# EAGLE design mainboard (EAGLE 9.6.1)
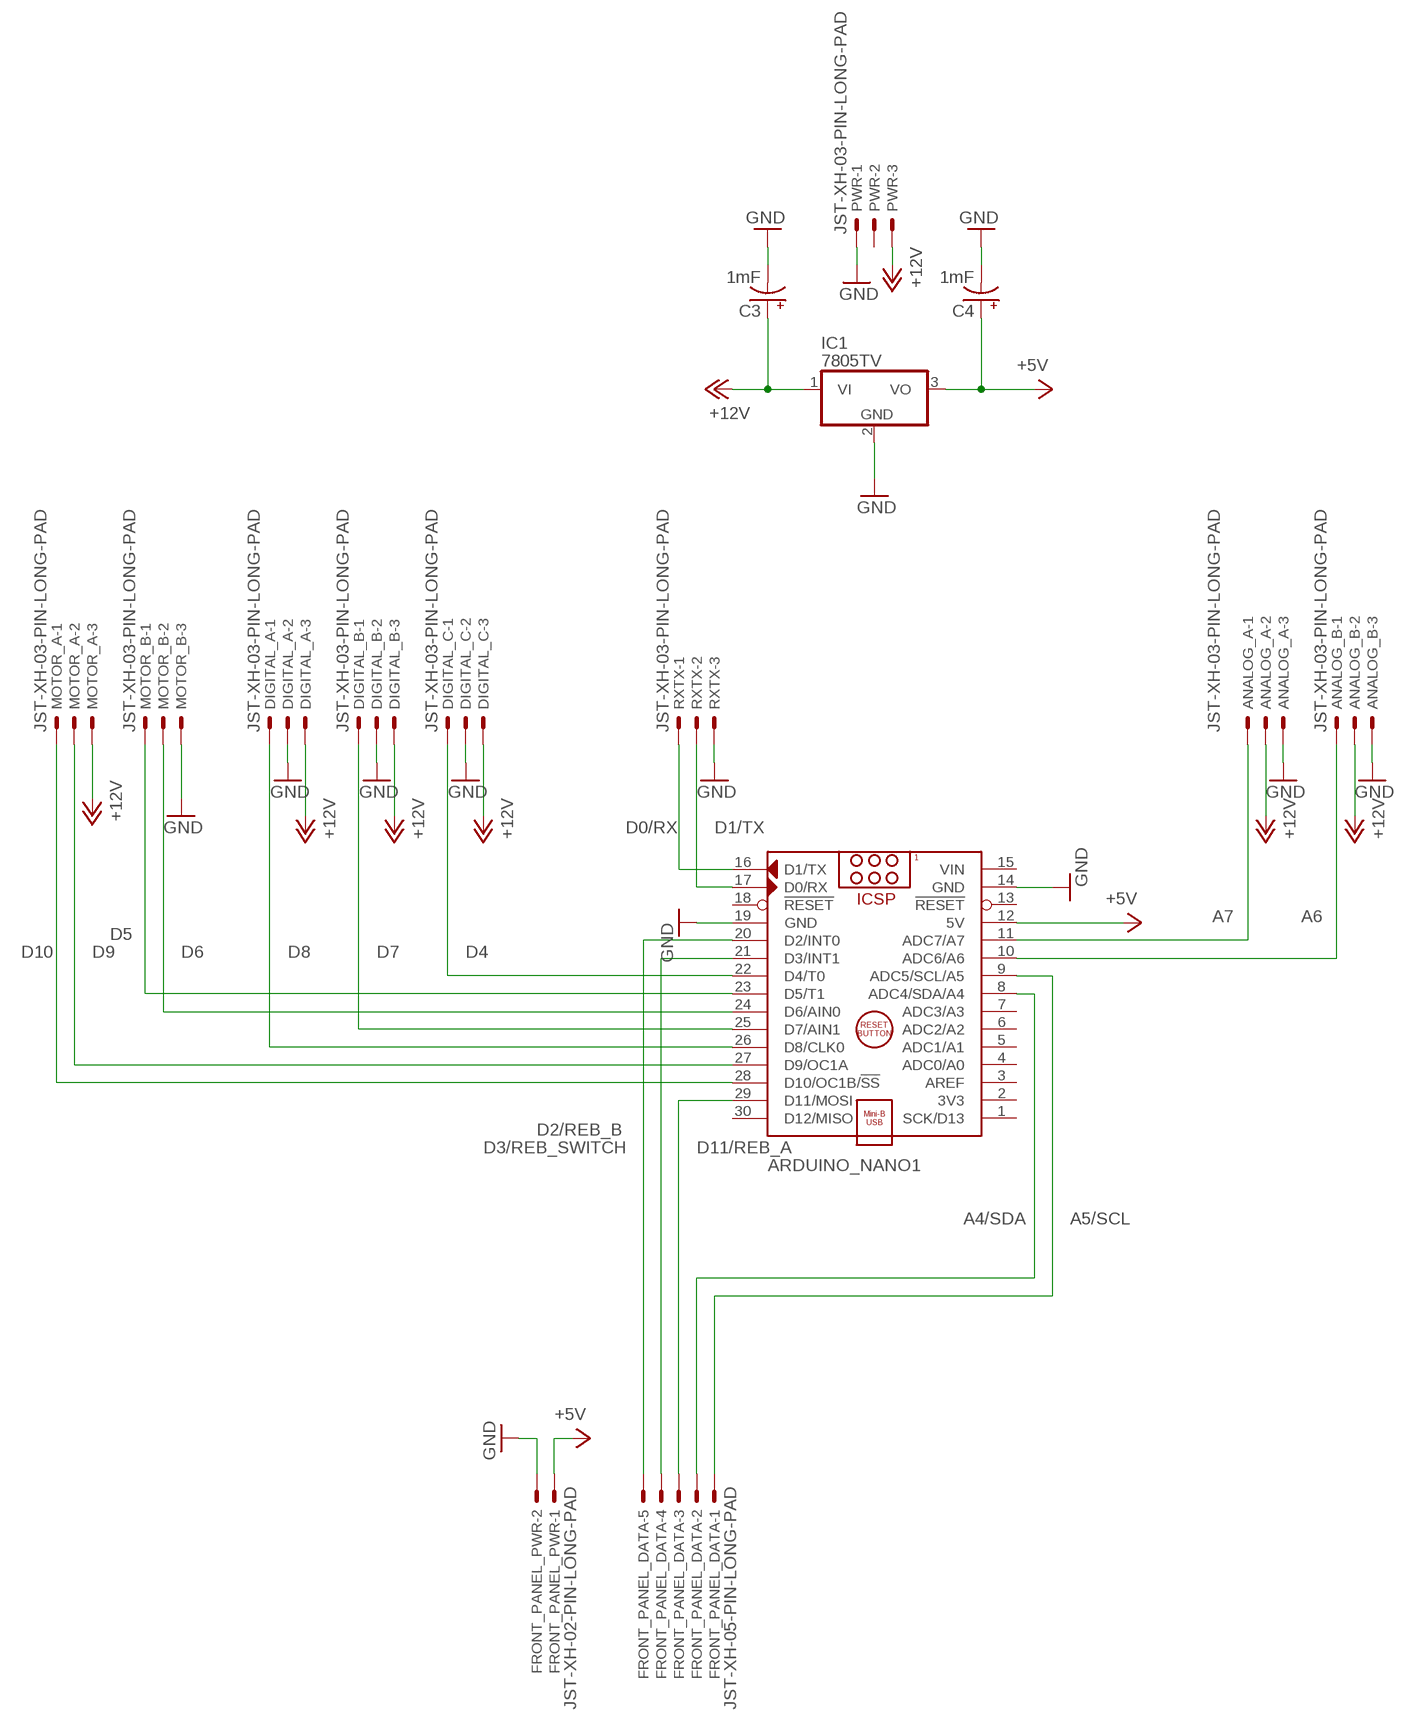
[diagram p0: schematic, sheet 1]

## Parts
ANALOG_A  JST-XH-03-PIN-LONG-PAD  [JST-XH-03-PACKAGE-LONG-PAD]
ANALOG_B  JST-XH-03-PIN-LONG-PAD  [JST-XH-03-PACKAGE-LONG-PAD]
ARDUINO_NANO1  ARDUINO_NANO  [ARDUINO_NANO]
C3  1mF  1000UF-RADIAL-5MM-25V-20%  [CPOL-RADIAL-5MM-10MM]
C4  1mF  1000UF-RADIAL-5MM-25V-20%  [CPOL-RADIAL-5MM-10MM]
DIGITAL_A  JST-XH-03-PIN-LONG-PAD  [JST-XH-03-PACKAGE-LONG-PAD]
DIGITAL_B  JST-XH-03-PIN-LONG-PAD  [JST-XH-03-PACKAGE-LONG-PAD]
DIGITAL_C  JST-XH-03-PIN-LONG-PAD  [JST-XH-03-PACKAGE-LONG-PAD]
FRONT_PANEL_DATA  JST-XH-05-PIN-LONG-PAD  [JST-XH-05-PACKAGE-LONG-PAD]
FRONT_PANEL_PWR  JST-XH-02-PIN-LONG-PAD  [JST-XH-02-PACKAGE-LONG-PAD]
IC1  7805TV  [TO220V]
MOTOR_A  JST-XH-03-PIN-LONG-PAD  [JST-XH-03-PACKAGE-LONG-PAD]
MOTOR_B  JST-XH-03-PIN-LONG-PAD  [JST-XH-03-PACKAGE-LONG-PAD]
PWR  JST-XH-03-PIN-LONG-PAD  [JST-XH-03-PACKAGE-LONG-PAD]
RXTX  JST-XH-03-PIN-LONG-PAD  [JST-XH-03-PACKAGE-LONG-PAD]

## Nets
+5V: ARDUINO_NANO1.12(5V) C4.+ FRONT_PANEL_PWR.1 IC1.3(VO)
+12V: ANALOG_A.2 ANALOG_B.2 C3.+ DIGITAL_A.3 DIGITAL_B.3 DIGITAL_C.3 IC1.1(VI) MOTOR_A.3 PWR.3
A4/SDA: ARDUINO_NANO1.8(ADC4/SDA/A4) FRONT_PANEL_DATA.2
A5/SCL: ARDUINO_NANO1.9(ADC5/SCL/A5) FRONT_PANEL_DATA.1
A6: ANALOG_B.1 ARDUINO_NANO1.10(ADC6/A6)
A7: ANALOG_A.1 ARDUINO_NANO1.11(ADC7/A7)
D0/RX: ARDUINO_NANO1.17(D0/RX) RXTX.2
D1/TX: ARDUINO_NANO1.16(D1/TX) RXTX.1
D2/REB_B: ARDUINO_NANO1.20(D2/INT0) FRONT_PANEL_DATA.5
D3/REB_SWITCH: ARDUINO_NANO1.21(D3/INT1) FRONT_PANEL_DATA.4
D4: ARDUINO_NANO1.22(D4/T0) DIGITAL_C.1
D5: ARDUINO_NANO1.23(D5/T1) MOTOR_B.1
D6: ARDUINO_NANO1.24(D6/AIN0) MOTOR_B.2
D7: ARDUINO_NANO1.25(D7/AIN1) DIGITAL_B.1
D8: ARDUINO_NANO1.26(D8/CLK0) DIGITAL_A.1
D9: ARDUINO_NANO1.27(D9/OC1A) MOTOR_A.2
D10: ARDUINO_NANO1.28(D10/OC1B/!SS) MOTOR_A.1
D11/REB_A: ARDUINO_NANO1.29(D11/MOSI) FRONT_PANEL_DATA.3
GND: ANALOG_A.3 ANALOG_B.3 ARDUINO_NANO1.14(GND) ARDUINO_NANO1.19(GND) C3.- C4.- DIGITAL_A.2 DIGITAL_B.2 DIGITAL_C.2 FRONT_PANEL_PWR.2 IC1.2(GND) MOTOR_B.3 PWR.1 RXTX.3
Unconnected: ARDUINO_NANO1.1(SCK/D13) ARDUINO_NANO1.2(3V3) ARDUINO_NANO1.3(AREF) ARDUINO_NANO1.4(ADC0/A0) ARDUINO_NANO1.5(ADC1/A1) ARDUINO_NANO1.6(ADC2/A2) ARDUINO_NANO1.7(ADC3/A3) ARDUINO_NANO1.13(!RESET) ARDUINO_NANO1.18(!RESET) ARDUINO_NANO1.30(D12/MISO) PWR.2

## Power pins joined to a net without a drawn wire
VIN: ARDUINO_NANO1.15(VIN)

## Library data of the parts
ANALOG_A ANALOG_B DIGITAL_A DIGITAL_B DIGITAL_C MOTOR_A MOTOR_B PWR RXTX = Rembrandt Electronics - JST XH Connectors v1-0:JST-XH-03-PIN: JST XH Connector 2 Pin Wire to board connector. Pitch: 2,54 mm, (0.100") Number of pins: 3 Created by Rembrandt Electronics www.rembrandtelectronics.com
ARDUINO_NANO1 = ArduinoNanoV30:ARDUINO_NANO: Arduino Nano V3.0 Module Overview: The Arduino Nano is a small, complete, and breadboard-friendly board based on the ATmega328 (Arduino Nano 3.x) or ATmega168 (Arduino Nano 2.x). It has more or less the same functionality of the Arduino Duemilanove, but in a different package. It lacks only a DC power jack, and works with a Mini-B USB cable instead of a standard one. The Nano was designed and is being produced by Gravitech <http://www.gravitech.us/arna30wiatp.html>. General specifications: Item Value Microcontroller Atmel ATmega168 or ATmega328 Operating Voltage (logic level) 5 V Input Voltage (recommended) 7-12 V Input Voltage (limits) 6-20 V Digital I/O Pins 14 (of which 6 provide PWM output) Analog Input Pins 8 DC Current per I/O Pin 40 mA Flash Memory 16 KB (ATmega168) or 32 KB (ATmega328) of which 2 KB used by bootloader SRAM 1 KB (ATmega168) or 2 KB (ATmega328) EEPROM 512 bytes (ATmega168) or 1 KB (ATmega328) Clock Speed 16 MHz Dimensions (Inches) 0.73" x 1.70" Dimensions (mm) 18mm x 45mm Overall height About 9 mm (not including pins) Weigth 5 g Power: The Arduino Nano can be powered via the Mini-B USB connection, 6-20V unregulated external power supply (pin 30), or 5V regulated external power supply (pin 27). The power source is automatically selected to the highest voltage source. Memory: The ATmega168 has 16 KB of flash memory for storing code (of which 2 KB is used for the bootloader); the ATmega328 has 32 KB, (also with 2 KB used for the bootloader). The ATmega168 has 1 KB of SRAM and 512 bytes of EEPROM (which can be read and written with the EEPROM library); the ATmega328 has 2 KB of SRAM and 1 KB of EEPROM. Input and Output: Each of the 14 digital pins on the Nano can be used as an input or output, using pinMode(), digitalWrite(), and digitalRead() functions. They operate at 5 volts. Each pin can provide or receive a maximum of 40 mA and has an internal pull-up resistor (disconnected by default) of 20-50 kOhms. In addition, some pins have specialized functions. Visit Arduino - ArduinoBoardNano <https://www.arduino.cc/en/Main/ArduinoBoardNano>
C3 C4 = SparkFun-Capacitors:1000UF: 1,000µF/1mF ceramic capacitors A capacitor is a passive two-terminal electrical component used to store electrical energy temporarily in an electric field. CAP-08070; PROD_ID: CAP-09538
FRONT_PANEL_DATA = Rembrandt Electronics - JST XH Connectors v1-0:JST-XH-05-PIN: JST XH Connector 2 Pin Wire to board connector. Pitch: 2,54 mm, (0.100") Number of pins: 5 Created by Rembrandt Electronics www.rembrandtelectronics.com
FRONT_PANEL_PWR = Rembrandt Electronics - JST XH Connectors v1-0:JST-XH-02-PIN: JST XH Connector 2 Pin Wire to board connector. Pitch: 2,54 mm, (0.100") Number of pins: 2 Created by Rembrandt Electronics www.rembrandtelectronics.com
IC1 = linear:78*: Positive VOLTAGE REGULATOR Source: http://cache.national.com/ds/LM/LM78L05.pdf http://www.fairchildsemi.com/ds/LM/LM7805.pdf

## Board
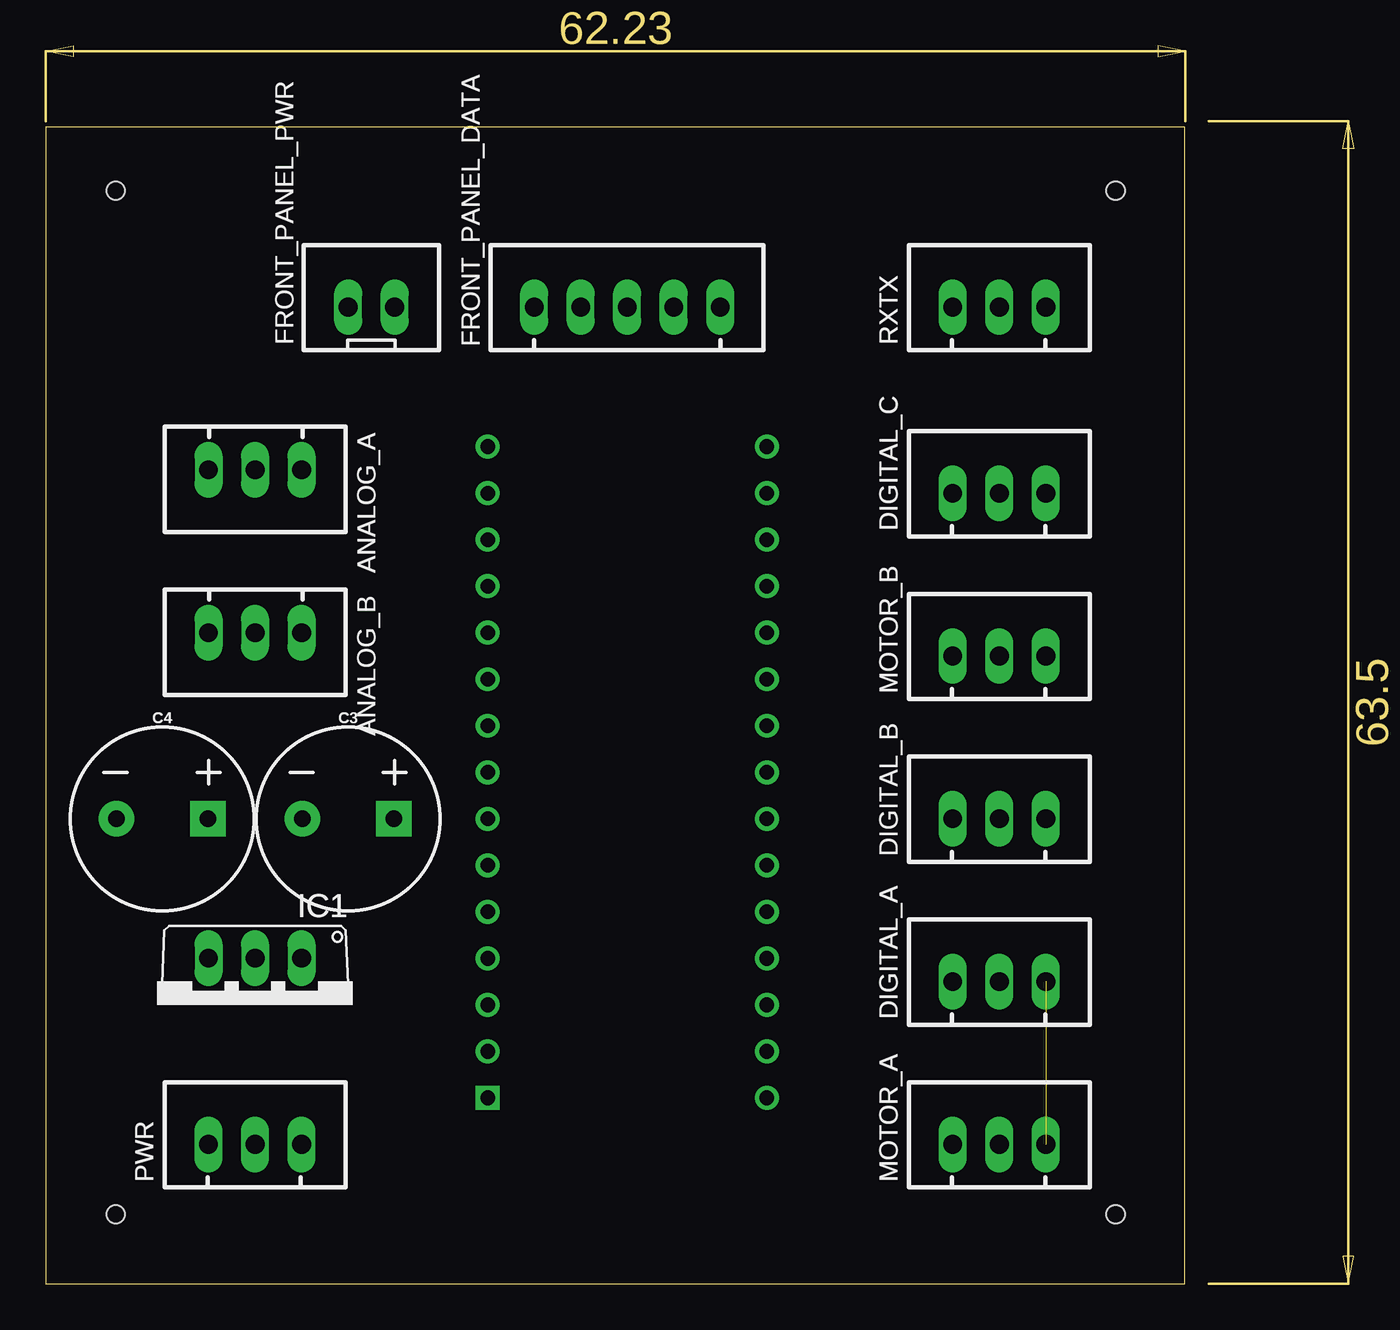
[diagram p1: board, top side]
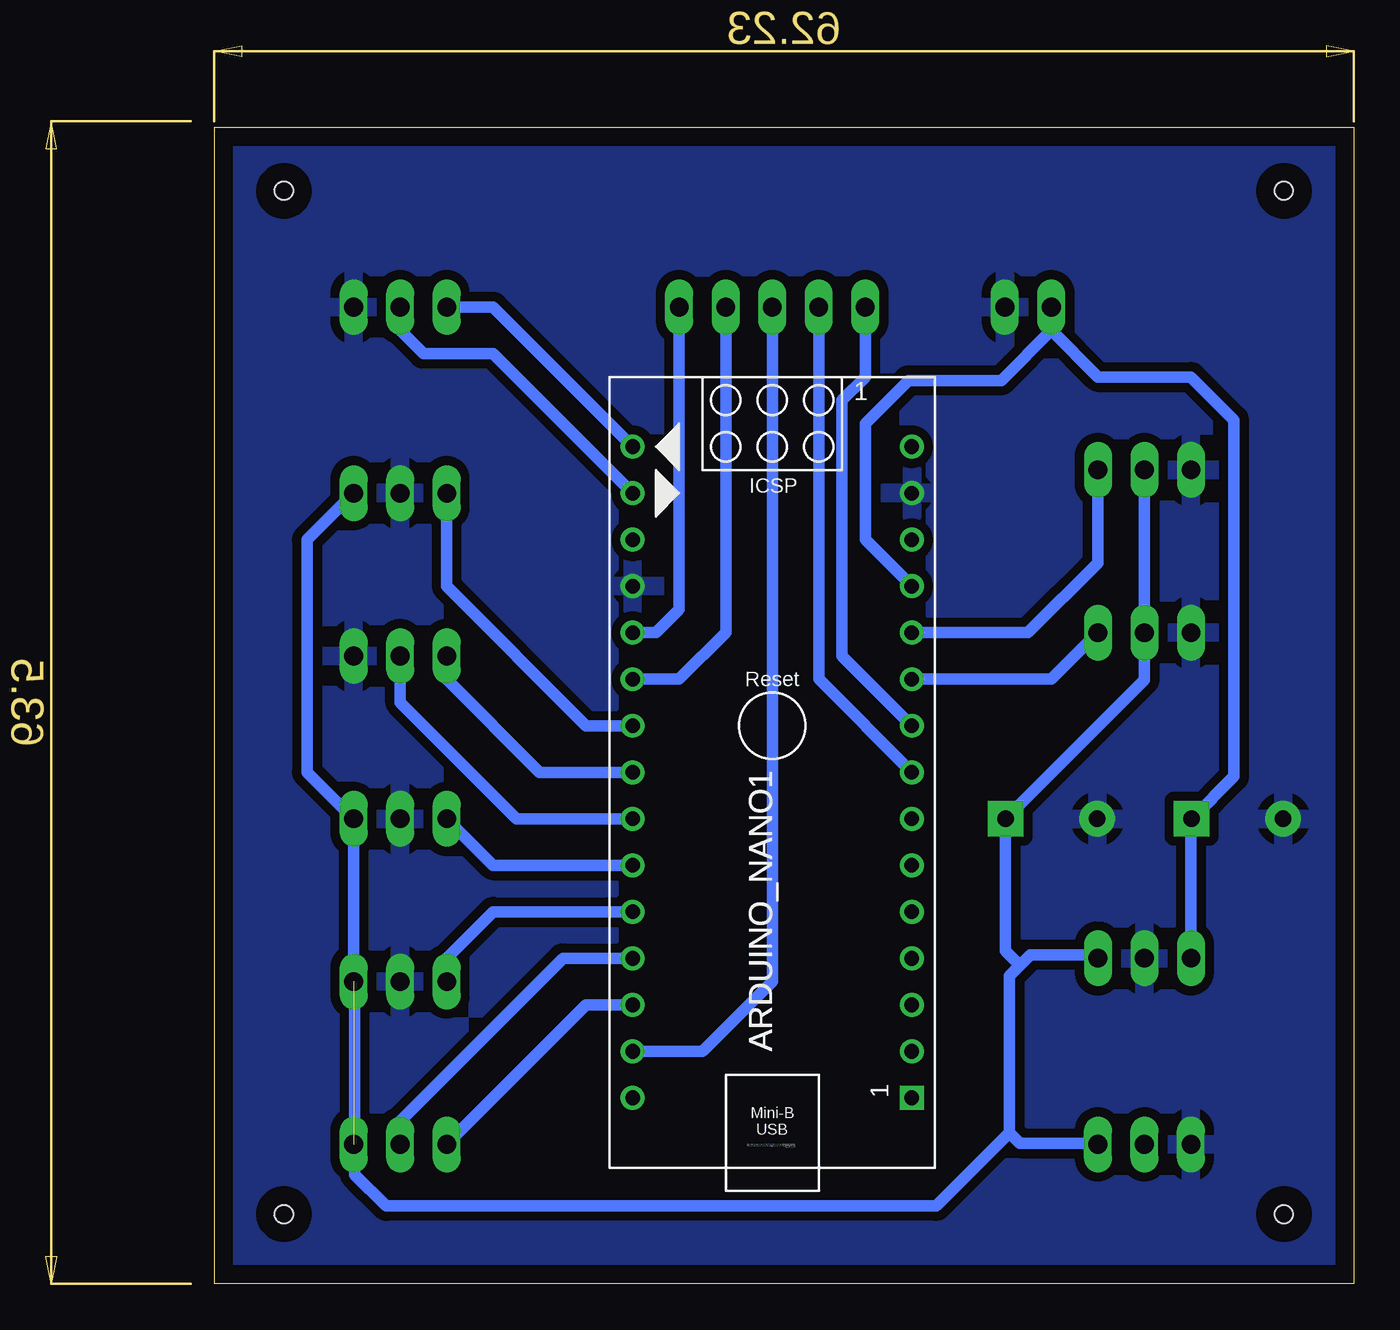
[diagram p2: board, bottom side, seen from below]

Size 62.21 x 63.17 mm. Coordinates in mm from the lower left corner, seen from the top.
Outline: 0,0 62.21,0 62.21,63.17 0,63.17 0,0
Copper layers (1*16): Top 0.035mm / dielectric 1.5mm / Bottom 0.035mm
Design rules "default2": minimum track width 25mil, minimum drill 0.35mm, track to track 20mil, track to pad 20mil, pad to pad 20mil, via to via 20mil, smd to smd 20mil, copper to edge 40mil, drill to drill 6mil, minimum pad ring 10mil, minimum via ring 8mil, stop-mask expansion 4mil, vias tented up to drill 0mil, thermal gap 20mil
Holes 1 mm at 3.81,59.69 58.42,59.69 58.42,3.81 3.81,3.81

### Footprints (pad centres in the part's own frame; a part is rotated, then mirrored left to right if it is on the bottom)
JST-XH-03-PACKAGE-LONG-PAD = drill 1.016 long: 1 -2.54,0; 2 0,0; 3 2.54,0
ARDUINO_NANO = drill 0.8 square: 1 -20.32,-7.62 | drill 0.8: 2 -17.78,-7.62; 3 -15.24,-7.62; 4 -12.7,-7.62; 5 -10.16,-7.62; 6 -7.62,-7.62; 7 -5.08,-7.62; 8 -2.54,-7.62; 9 0,-7.62; 10 2.54,-7.62; 11 5.08,-7.62; 12 7.62,-7.62; 13 10.16,-7.62; 14 12.7,-7.62; 15 15.24,-7.62; 16 15.24,7.62; 17 12.7,7.62; 18 10.16,7.62; 19 7.62,7.62; 20 5.08,7.62; 21 2.54,7.62; 22 0,7.62; 23 -2.54,7.62; 24 -5.08,7.62; 25 -7.62,7.62; 26 -10.16,7.62; 27 -12.7,7.62; 28 -15.24,7.62; 29 -17.78,7.62; 30 -20.32,7.62
CPOL-RADIAL-5MM-10MM = drill 0.9 pad 1.93 square: + 2.5,0 | drill 0.9 pad 1.93: - -2.5,0
JST-XH-05-PACKAGE-LONG-PAD = drill 1.016 long: 1 -5.08,0; 2 -2.54,0; 3 0,0; 4 2.54,0; 5 5.08,0
JST-XH-02-PACKAGE-LONG-PAD = drill 1.016 long: 1 -1.27,0; 2 1.27,0
TO220V = drill 1.016 long: 1 -2.54,-2.54; 2 0,-2.54; 3 2.54,-2.54

### Placement (x,y rotation side)
ANALOG_A  11.43,44.45 180 top
ANALOG_B  11.43,35.56 180 top
ARDUINO_NANO1  31.75,30.48 90 bottom
C3  16.51,25.4 0 top
C4  6.35,25.4 0 top
DIGITAL_A  52.07,16.51 0 top
DIGITAL_B  52.07,25.4 0 top
DIGITAL_C  52.07,43.18 0 top
FRONT_PANEL_DATA  31.75,53.34 0 top
FRONT_PANEL_PWR  17.78,53.34 0 top
IC1  11.43,15.24 180 top
MOTOR_A  52.07,7.62 0 top
MOTOR_B  52.07,34.29 0 top
PWR  11.43,7.62 0 top
RXTX  52.07,53.34 0 top

### Tracks (layer width: path | path; a pad name or v marks a point on that pad's centre or on a via)
+5V
  Bottom 0.635: C4.+ 6.54,27.71 6.54,47.18 8.89,49.53 13.97,49.53 16.51,52.07 | C4.+ 9.08,25.4 | C4.+ 8.89,25.36 IC1.3 | ARDUINO_NANO1.12 26.67,40.64 26.67,46.99 24.32,49.34 19.24,49.34 16.51,52.07 | FRONT_PANEL_PWR.1 16.51,52.07
+12V  (1 unrouted)
  Bottom 0.635: 18.8,8.26 18.22,7.68 13.97,7.68 PWR.3 | 18.8,8.26 18.8,16.83 18.22,17.4 | 18.22,17.4 17.65,17.97 13.97,17.97 IC1.1 | ANALOG_A.2 ANALOG_B.2 11.43,32.98 C3.+ 19.01,18.18 18.22,17.4 | 18.8,8.26 22.8,4.25 52.83,4.25 54.55,5.97 54.55,16.45 DIGITAL_A.3 DIGITAL_B.3 57.15,27.94 57.15,40.64 DIGITAL_C.3
A4/SDA
  Bottom 0.635: ARDUINO_NANO1.8 29.21,33.02 FRONT_PANEL_DATA.2
A5/SCL
  Bottom 0.635: ARDUINO_NANO1.9 27.94,34.29 27.94,48.26 26.67,49.53 FRONT_PANEL_DATA.1
A6
  Bottom 0.635: ANALOG_B.1 16.51,33.02 ARDUINO_NANO1.10
A7
  Bottom 0.635: ARDUINO_NANO1.11 17.78,35.56 13.97,39.37 ANALOG_A.1
D0/RX
  Bottom 0.635: RXTX.2 52.07,52.07 50.8,50.8 46.99,50.8 ARDUINO_NANO1.17
D1/TX
  Bottom 0.635: ARDUINO_NANO1.16 46.99,53.34 RXTX.1
D2/REB_B
  Bottom 0.635: FRONT_PANEL_DATA.5 36.83,36.83 38.1,35.56 ARDUINO_NANO1.20
D3/REB_SWITCH
  Bottom 0.635: FRONT_PANEL_DATA.4 34.29,35.56 36.83,33.02 ARDUINO_NANO1.21
D4
  Bottom 0.635: DIGITAL_C.1 49.53,38.1 41.91,30.48 ARDUINO_NANO1.22
D5
  Bottom 0.635: MOTOR_B.1 49.53,33.02 44.45,27.94 ARDUINO_NANO1.23
D6
  Bottom 0.635: MOTOR_B.2 52.07,31.75 45.72,25.4 ARDUINO_NANO1.24
D7
  Bottom 0.635: DIGITAL_B.1 46.99,22.86 ARDUINO_NANO1.25
D8
  Bottom 0.635: DIGITAL_A.1 49.53,17.78 46.99,20.32 ARDUINO_NANO1.26
D9
  Bottom 0.635: MOTOR_A.2 52.07,8.89 43.18,17.78 ARDUINO_NANO1.27
D10
  Bottom 0.635: MOTOR_A.1 41.91,15.24 ARDUINO_NANO1.28
D11/REB_A
  Bottom 0.635: ARDUINO_NANO1.29 35.56,12.7 31.75,16.51 FRONT_PANEL_DATA.3
GND
  pour Bottom: -2.54,66.04 64.77,66.04 64.77,-2.54 -2.54,-2.54

### Text on the board
_bPlace: ARDUINO_NANO1 | ARDUINO_NANO1
_tNames: FRONT_PANEL_PWR | FRONT_PANEL_PWR | FRONT_PANEL_DATA | FRONT_PANEL_DATA | RXTX | RXTX | ANALOG_A | ANALOG_A | DIGITAL_C | DIGITAL_C | ANALOG_B | ANALOG_B | MOTOR_B | MOTOR_B | C4 | C4 | C3 | C3 | DIGITAL_B | DIGITAL_B | IC1 | IC1 | DIGITAL_A | DIGITAL_A | PWR | PWR | MOTOR_A | MOTOR_A